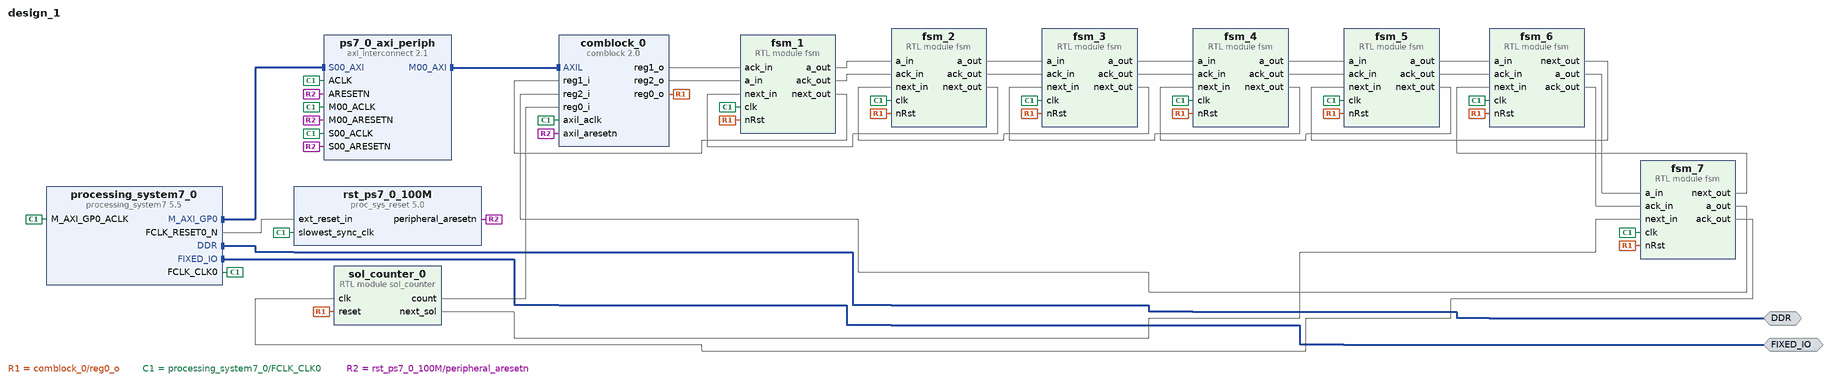
[diagram p0: block diagram of the top level]
# Vivado block design design_1, xc7z020clg484-1, Vivado 2021.2
create_bd_design design_1

create_bd_intf_port -mode Master -vlnv xilinx.com:interface:ddrx_rtl:1.0 DDR
create_bd_intf_port -mode Master -vlnv xilinx.com:display_processing_system7:fixedio_rtl:1.0 FIXED_IO

create_bd_cell -type ip -vlnv xilinx.com:ip:processing_system7:5.5 processing_system7_0
set_property -dict [list \
  CONFIG.PCW_APU_PERIPHERAL_FREQMHZ 666.666667 \
  CONFIG.PCW_ENET0_ENET0_IO {MIO 16 .. 27} \
  CONFIG.PCW_ENET0_GRP_MDIO_ENABLE 1 \
  CONFIG.PCW_ENET0_GRP_MDIO_IO {MIO 52 .. 53} \
  CONFIG.PCW_ENET0_PERIPHERAL_ENABLE 1 \
  CONFIG.PCW_ENET0_RESET_ENABLE 0 \
  CONFIG.PCW_ENET_RESET_ENABLE 1 \
  CONFIG.PCW_ENET_RESET_SELECT {Share reset pin} \
  CONFIG.PCW_FPGA0_PERIPHERAL_FREQMHZ 100.000000 \
  CONFIG.PCW_FPGA1_PERIPHERAL_FREQMHZ 150.000000 \
  CONFIG.PCW_FPGA2_PERIPHERAL_FREQMHZ 50.000000 \
  CONFIG.PCW_GPIO_MIO_GPIO_ENABLE 1 \
  CONFIG.PCW_GPIO_MIO_GPIO_IO MIO \
  CONFIG.PCW_I2C_RESET_ENABLE 1 \
  CONFIG.PCW_PRESET_BANK1_VOLTAGE {LVCMOS 1.8V} \
  CONFIG.PCW_QSPI_GRP_SINGLE_SS_ENABLE 1 \
  CONFIG.PCW_QSPI_GRP_SINGLE_SS_IO {MIO 1 .. 6} \
  CONFIG.PCW_QSPI_PERIPHERAL_ENABLE 1 \
  CONFIG.PCW_QSPI_PERIPHERAL_FREQMHZ 200.000000 \
  CONFIG.PCW_QSPI_QSPI_IO {MIO 1 .. 6} \
  CONFIG.PCW_SD0_GRP_CD_ENABLE 1 \
  CONFIG.PCW_SD0_GRP_CD_IO {MIO 47} \
  CONFIG.PCW_SD0_GRP_WP_ENABLE 1 \
  CONFIG.PCW_SD0_GRP_WP_IO {MIO 46} \
  CONFIG.PCW_SD0_PERIPHERAL_ENABLE 1 \
  CONFIG.PCW_SD0_SD0_IO {MIO 40 .. 45} \
  CONFIG.PCW_SDIO_PERIPHERAL_FREQMHZ 50 \
  CONFIG.PCW_SINGLE_QSPI_DATA_MODE x4 \
  CONFIG.PCW_TTC0_PERIPHERAL_ENABLE 1 \
  CONFIG.PCW_TTC0_TTC0_IO EMIO \
  CONFIG.PCW_UART1_PERIPHERAL_ENABLE 1 \
  CONFIG.PCW_UART1_UART1_IO {MIO 48 .. 49} \
  CONFIG.PCW_UART_PERIPHERAL_FREQMHZ 50 \
  CONFIG.PCW_UIPARAM_DDR_FREQ_MHZ 533.333313 \
  CONFIG.PCW_UIPARAM_DDR_PARTNO {MT41J128M16 HA-15E} \
  CONFIG.PCW_USB0_PERIPHERAL_ENABLE 1 \
  CONFIG.PCW_USB0_RESET_ENABLE 0 \
  CONFIG.PCW_USB0_USB0_IO {MIO 28 .. 39} \
  CONFIG.PCW_USB_RESET_ENABLE 1 \
  CONFIG.PCW_USB_RESET_SELECT {Share reset pin} \
  CONFIG.preset ZedBoard \
] [get_bd_cells processing_system7_0]
# 221 more settings of processing_system7_0 are not shown: defaults, MIO pin electricals, DDR timing, and values the tool derives
create_bd_cell -type ip -vlnv www.ictp.it:user:comblock:2.0 comblock_0
set_property -dict [list \
  CONFIG.DRAM_IO_ENA false \
  CONFIG.FIFO_IN_ENA false \
  CONFIG.REGS_IN_DEPTH 3 \
  CONFIG.REGS_IN_DWIDTH 32 \
  CONFIG.REGS_OUT_DEPTH 3 \
  CONFIG.REGS_OUT_DWIDTH 4 \
] [get_bd_cells comblock_0]
create_bd_cell -type ip -vlnv xilinx.com:ip:axi_interconnect:2.1 ps7_0_axi_periph
set_property -dict {CONFIG.NUM_MI 1} [get_bd_cells ps7_0_axi_periph]
create_bd_cell -type ip -vlnv xilinx.com:ip:proc_sys_reset:5.0 rst_ps7_0_100M
create_bd_cell -type module -reference fsm fsm_1
set_property -dict {CONFIG.K 1 CONFIG.M 8 CONFIG.N 4} [get_bd_cells fsm_1]
create_bd_cell -type module -reference fsm fsm_2
set_property -dict {CONFIG.K 2 CONFIG.M 8 CONFIG.N 4} [get_bd_cells fsm_2]
create_bd_cell -type module -reference fsm fsm_3
set_property -dict {CONFIG.K 3 CONFIG.M 8 CONFIG.N 4} [get_bd_cells fsm_3]
create_bd_cell -type module -reference fsm fsm_4
set_property -dict {CONFIG.K 4 CONFIG.M 8 CONFIG.N 4} [get_bd_cells fsm_4]
create_bd_cell -type module -reference fsm fsm_5
set_property -dict {CONFIG.K 5 CONFIG.M 8 CONFIG.N 4} [get_bd_cells fsm_5]
create_bd_cell -type module -reference fsm fsm_6
set_property -dict {CONFIG.K 6 CONFIG.M 8 CONFIG.N 4} [get_bd_cells fsm_6]
create_bd_cell -type module -reference fsm fsm_7
set_property -dict {CONFIG.K 7 CONFIG.M 8 CONFIG.N 4} [get_bd_cells fsm_7]
create_bd_cell -type module -reference sol_counter sol_counter_0
set_property -dict {CONFIG.N 32} [get_bd_cells sol_counter_0]

# ---- connections ----

connect_bd_intf_net [get_bd_intf_ports DDR] [get_bd_intf_pins processing_system7_0/DDR]
connect_bd_intf_net [get_bd_intf_ports FIXED_IO] [get_bd_intf_pins processing_system7_0/FIXED_IO]
connect_bd_intf_net [get_bd_intf_pins processing_system7_0/M_AXI_GP0] [get_bd_intf_pins ps7_0_axi_periph/S00_AXI]
connect_bd_intf_net [get_bd_intf_pins ps7_0_axi_periph/M00_AXI] [get_bd_intf_pins comblock_0/AXIL]
connect_bd_net [get_bd_pins comblock_0/reg0_o] \
  [get_bd_pins fsm_7/nRst] [get_bd_pins fsm_6/nRst] [get_bd_pins fsm_5/nRst] [get_bd_pins fsm_4/nRst] \
  [get_bd_pins fsm_3/nRst] [get_bd_pins fsm_2/nRst] [get_bd_pins fsm_1/nRst] [get_bd_pins sol_counter_0/reset]
connect_bd_net [get_bd_pins comblock_0/reg1_o] [get_bd_pins fsm_1/ack_in]
connect_bd_net [get_bd_pins comblock_0/reg2_o] [get_bd_pins fsm_1/a_in]
connect_bd_net [get_bd_pins fsm_1/a_out] [get_bd_pins fsm_2/a_in]
connect_bd_net [get_bd_pins fsm_1/ack_out] [get_bd_pins fsm_2/ack_in]
connect_bd_net [get_bd_pins fsm_1/next_out] [get_bd_pins comblock_0/reg1_i]
connect_bd_net [get_bd_pins fsm_2/a_out] [get_bd_pins fsm_3/a_in]
connect_bd_net [get_bd_pins fsm_2/ack_out] [get_bd_pins fsm_3/ack_in]
connect_bd_net [get_bd_pins fsm_2/next_out] [get_bd_pins fsm_1/next_in]
connect_bd_net [get_bd_pins fsm_3/a_out] [get_bd_pins fsm_4/a_in]
connect_bd_net [get_bd_pins fsm_3/ack_out] [get_bd_pins fsm_4/ack_in]
connect_bd_net [get_bd_pins fsm_3/next_out] [get_bd_pins fsm_2/next_in]
connect_bd_net [get_bd_pins fsm_4/a_out] [get_bd_pins fsm_5/a_in]
connect_bd_net [get_bd_pins fsm_4/ack_out] [get_bd_pins fsm_5/ack_in]
connect_bd_net [get_bd_pins fsm_4/next_out] [get_bd_pins fsm_3/next_in]
connect_bd_net [get_bd_pins fsm_5/a_out] [get_bd_pins fsm_6/a_in]
connect_bd_net [get_bd_pins fsm_5/ack_out] [get_bd_pins fsm_6/ack_in]
connect_bd_net [get_bd_pins fsm_5/next_out] [get_bd_pins fsm_4/next_in]
connect_bd_net [get_bd_pins fsm_6/a_out] [get_bd_pins fsm_7/a_in]
connect_bd_net [get_bd_pins fsm_6/ack_out] [get_bd_pins fsm_7/ack_in]
connect_bd_net [get_bd_pins fsm_6/next_out] [get_bd_pins fsm_5/next_in]
connect_bd_net [get_bd_pins fsm_7/a_out] [get_bd_pins comblock_0/reg2_i]
connect_bd_net [get_bd_pins fsm_7/ack_out] [get_bd_pins sol_counter_0/clk]
connect_bd_net [get_bd_pins fsm_7/next_out] [get_bd_pins fsm_6/next_in]
connect_bd_net [get_bd_pins processing_system7_0/FCLK_CLK0] \
  [get_bd_pins comblock_0/axil_aclk] [get_bd_pins ps7_0_axi_periph/M00_ACLK] [get_bd_pins fsm_1/clk] [get_bd_pins fsm_2/clk] \
  [get_bd_pins fsm_3/clk] [get_bd_pins fsm_4/clk] [get_bd_pins fsm_5/clk] [get_bd_pins fsm_6/clk] [get_bd_pins fsm_7/clk] \
  [get_bd_pins processing_system7_0/M_AXI_GP0_ACLK] [get_bd_pins ps7_0_axi_periph/S00_ACLK] \
  [get_bd_pins ps7_0_axi_periph/ACLK] [get_bd_pins rst_ps7_0_100M/slowest_sync_clk]
connect_bd_net [get_bd_pins processing_system7_0/FCLK_RESET0_N] [get_bd_pins rst_ps7_0_100M/ext_reset_in]
connect_bd_net [get_bd_pins rst_ps7_0_100M/peripheral_aresetn] \
  [get_bd_pins ps7_0_axi_periph/S00_ARESETN] [get_bd_pins comblock_0/axil_aresetn] [get_bd_pins ps7_0_axi_periph/M00_ARESETN] \
  [get_bd_pins ps7_0_axi_periph/ARESETN]
connect_bd_net [get_bd_pins sol_counter_0/count] [get_bd_pins comblock_0/reg0_i]
connect_bd_net [get_bd_pins sol_counter_0/next_sol] [get_bd_pins fsm_7/next_in]

# ---- address map ----
assign_bd_address -offset 0x43C00000 -range 64K -target_address_space [get_bd_addr_spaces processing_system7_0/Data] [get_bd_addr_segs comblock_0/AXIL/AXIL]

validate_bd_design
save_bd_design
